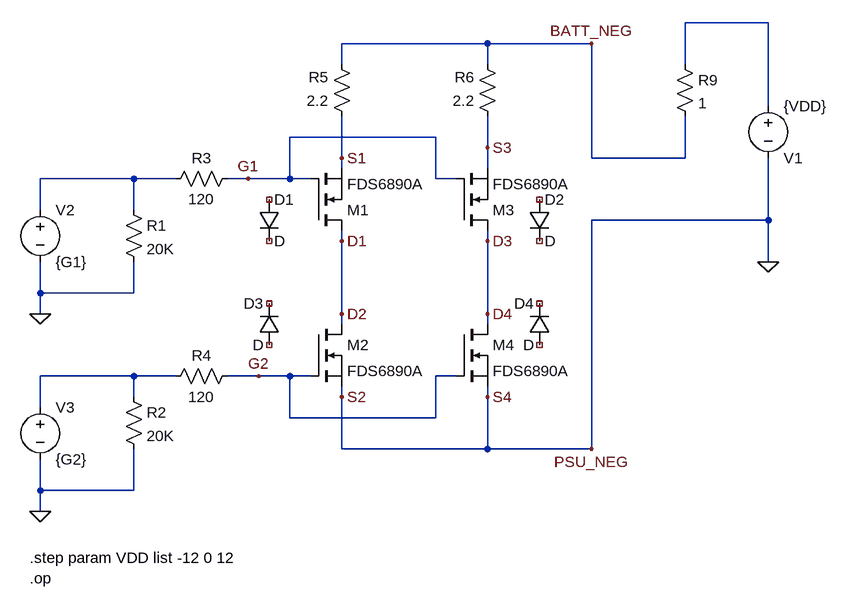
[diagram p0: schematic MosfetPowerControlSim.asc]
MosfetPowerControlSim.asc, the LTspice schematic file:
Version 4
SHEET 1 1684 752
WIRE 1360 -256 1232 -256
WIRE 928 -224 704 -224
WIRE 1088 -224 928 -224
WIRE 704 -192 704 -224
WIRE 928 -192 928 -224
WIRE 1232 -192 1232 -256
WIRE 1360 -128 1360 -256
WIRE 848 -80 624 -80
WIRE 928 -64 928 -112
WIRE 704 -48 704 -112
WIRE 1088 -48 1088 -224
WIRE 1232 -48 1232 -112
WIRE 1232 -48 1088 -48
WIRE 704 -32 704 -48
WIRE 928 -32 928 -64
WIRE 384 -16 240 -16
WIRE 448 -16 384 -16
WIRE 560 -16 528 -16
WIRE 624 -16 624 -80
WIRE 624 -16 560 -16
WIRE 656 -16 624 -16
WIRE 848 -16 848 -80
WIRE 880 -16 848 -16
WIRE 240 32 240 -16
WIRE 384 32 384 -16
WIRE 1360 48 1360 -48
WIRE 1360 48 1088 48
WIRE 704 80 704 64
WIRE 928 80 928 64
WIRE 1360 112 1360 48
WIRE 240 160 240 112
WIRE 384 160 384 112
WIRE 384 160 240 160
WIRE 240 192 240 160
WIRE 704 192 704 80
WIRE 928 192 928 80
WIRE 704 208 704 192
WIRE 928 208 928 192
WIRE 384 288 240 288
WIRE 448 288 384 288
WIRE 576 288 528 288
WIRE 624 288 576 288
WIRE 656 288 624 288
WIRE 880 288 848 288
WIRE 384 320 384 288
WIRE 704 320 704 304
WIRE 928 320 928 304
WIRE 240 336 240 288
WIRE 624 352 624 288
WIRE 848 352 848 288
WIRE 848 352 624 352
WIRE 704 400 704 320
WIRE 928 400 928 320
WIRE 928 400 704 400
WIRE 1088 400 1088 48
WIRE 1088 400 928 400
WIRE 240 464 240 416
WIRE 384 464 384 400
WIRE 384 464 240 464
WIRE 240 496 240 464
FLAG 240 192 0
FLAG 240 496 0
FLAG 1360 112 0
FLAG 560 -16 G1
FLAG 576 288 G2
FLAG 704 192 D2
FLAG 704 80 D1
FLAG 928 80 D3
FLAG 928 192 D4
FLAG 704 -48 S1
FLAG 704 320 S2
FLAG 928 320 S4
FLAG 928 -64 S3
FLAG 1088 -224 BATT_NEG
FLAG 1088 400 PSU_NEG
SYMBOL res 368 16 R0
SYMATTR InstName R1
SYMATTR Value 20K
SYMBOL res 368 304 R0
SYMATTR InstName R2
SYMATTR Value 20K
SYMBOL res 544 -32 R90
WINDOW 0 0 56 VBottom 2
WINDOW 3 32 56 VTop 2
SYMATTR InstName R3
SYMATTR Value 120
SYMBOL res 544 272 R90
WINDOW 0 0 56 VBottom 2
WINDOW 3 32 56 VTop 2
SYMATTR InstName R4
SYMATTR Value 120
SYMBOL res 720 -96 R180
WINDOW 0 36 76 Left 2
WINDOW 3 36 40 Left 2
SYMATTR InstName R5
SYMATTR Value 2.2
SYMBOL res 944 -96 R180
WINDOW 0 36 76 Left 2
WINDOW 3 36 40 Left 2
SYMATTR InstName R6
SYMATTR Value 2.2
SYMBOL res 1216 -208 R0
SYMATTR InstName R9
SYMATTR Value 1
SYMBOL nmos 656 64 M180
SYMATTR InstName M1
SYMATTR Value FDS6890A
SYMBOL nmos 880 64 M180
SYMATTR InstName M3
SYMATTR Value FDS6890A
SYMBOL nmos 880 208 R0
SYMATTR InstName M4
SYMATTR Value FDS6890A
SYMBOL voltage 1360 -144 R0
WINDOW 0 24 96 Left 2
WINDOW 3 24 16 Left 2
WINDOW 123 0 0 Left 0
WINDOW 39 0 0 Left 0
SYMATTR InstName V1
SYMATTR Value {VDD}
SYMBOL voltage 240 16 R0
SYMATTR InstName V2
SYMATTR Value {G1}
SYMBOL voltage 240 320 R0
SYMATTR InstName V3
SYMATTR Value {G2}
SYMBOL nmos 656 208 R0
SYMATTR InstName M2
SYMATTR Value FDS6890A
SYMBOL diode 576 16 R0
SYMATTR InstName D1
SYMBOL diode 992 16 R0
SYMATTR InstName D2
SYMBOL diode 608 240 R180
WINDOW 0 24 64 Left 2
WINDOW 3 24 0 Left 2
SYMATTR InstName D3
SYMBOL diode 1024 240 R180
WINDOW 0 24 64 Left 2
WINDOW 3 24 0 Left 2
SYMATTR InstName D4
TEXT 224 568 Left 2 !.step param VDD list -12 0 12\n.op

The netlist it stands for:
* MosfetPowerControlSim.asc
R1 N002 0 20K
R2 N003 0 20K
R3 G1 N002 120
R4 G2 N003 120
R5 S1 BATT_NEG 2.2
R6 S3 BATT_NEG 2.2
R9 N001 BATT_NEG 1
M1 D1 G1 S1 S1 FDS6890A
M3 D4 G1 S3 S3 FDS6890A
M4 D4 G2 0 0 FDS6890A
V1 N001 0 {VDD}
V2 N002 0 {G1}
V3 N003 0 {G2}
M2 D1 G2 0 0 FDS6890A
D1 NC_01 NC_02 D
D2 NC_03 NC_04 D
D3 NC_05 NC_06 D
D4 NC_07 NC_08 D
.model D D
.lib standard.dio
.model NMOS NMOS
.model PMOS PMOS
.lib standard.mos
.step param VDD list -12 0 12
.op
.backanno
.end